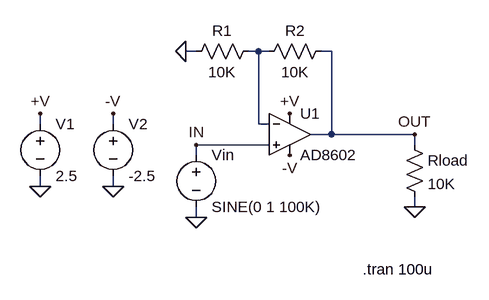
[diagram p0: schematic AD8602.asc]
AD8602.asc, the LTspice schematic file:
Version 4
SHEET 1 1240 700
WIRE 272 -944 256 -944
WIRE 368 -944 352 -944
WIRE 384 -944 368 -944
WIRE 480 -944 464 -944
WIRE 32 -832 32 -848
WIRE 144 -832 144 -848
WIRE 368 -832 368 -944
WIRE 384 -832 368 -832
WIRE 480 -816 480 -944
WIRE 480 -816 448 -816
WIRE 608 -816 480 -816
WIRE 384 -800 272 -800
WIRE 608 -800 608 -816
WIRE 272 -784 272 -800
WIRE 32 -736 32 -752
WIRE 144 -736 144 -752
WIRE 608 -704 608 -720
WIRE 272 -688 272 -704
FLAG 32 -848 +V
FLAG 32 -736 0
FLAG 272 -688 0
FLAG 608 -816 OUT
FLAG 272 -800 IN
FLAG 416 -848 +V
FLAG 144 -848 -V
FLAG 416 -784 -V
FLAG 256 -944 0
FLAG 608 -704 0
FLAG 144 -736 0
SYMBOL voltage 272 -800 R0
WINDOW 123 24 146 Left 2
WINDOW 39 24 125 Left 2
SYMATTR InstName Vin
SYMATTR Value SINE(0 1 100K)
SYMBOL Opamps\\AD8602 416 -880 R0
SYMATTR InstName U1
SYMBOL voltage 32 -848 R0
WINDOW 123 0 0 Left 2
WINDOW 39 0 0 Left 2
SYMATTR InstName V1
SYMATTR Value 2.5
SYMBOL res 368 -960 R90
WINDOW 0 0 56 VBottom 2
WINDOW 3 32 56 VTop 2
SYMATTR InstName R1
SYMATTR Value 10K
SYMBOL res 480 -960 R90
WINDOW 0 0 56 VBottom 2
WINDOW 3 32 56 VTop 2
SYMATTR InstName R2
SYMATTR Value 10K
SYMBOL voltage 144 -848 R0
WINDOW 123 24 146 Left 2
WINDOW 39 24 125 Left 2
SYMATTR InstName V2
SYMATTR Value -2.5
SYMBOL res 592 -816 R0
SYMATTR InstName Rload
SYMATTR Value 10K
TEXT 528 -608 Left 2 !.tran 100u

The netlist it stands for:
* AD8602.asc
Vin IN 0 SINE(0 1 100K)
XU1 IN N001 +V -V OUT AD8602  ; pins In+ In- V+ V- OUT
V1 +V 0 2.5
R1 N001 0 10K
R2 OUT N001 10K
V2 -V 0 -2.5
Rload OUT 0 10K
.tran 100u
.backanno
.end